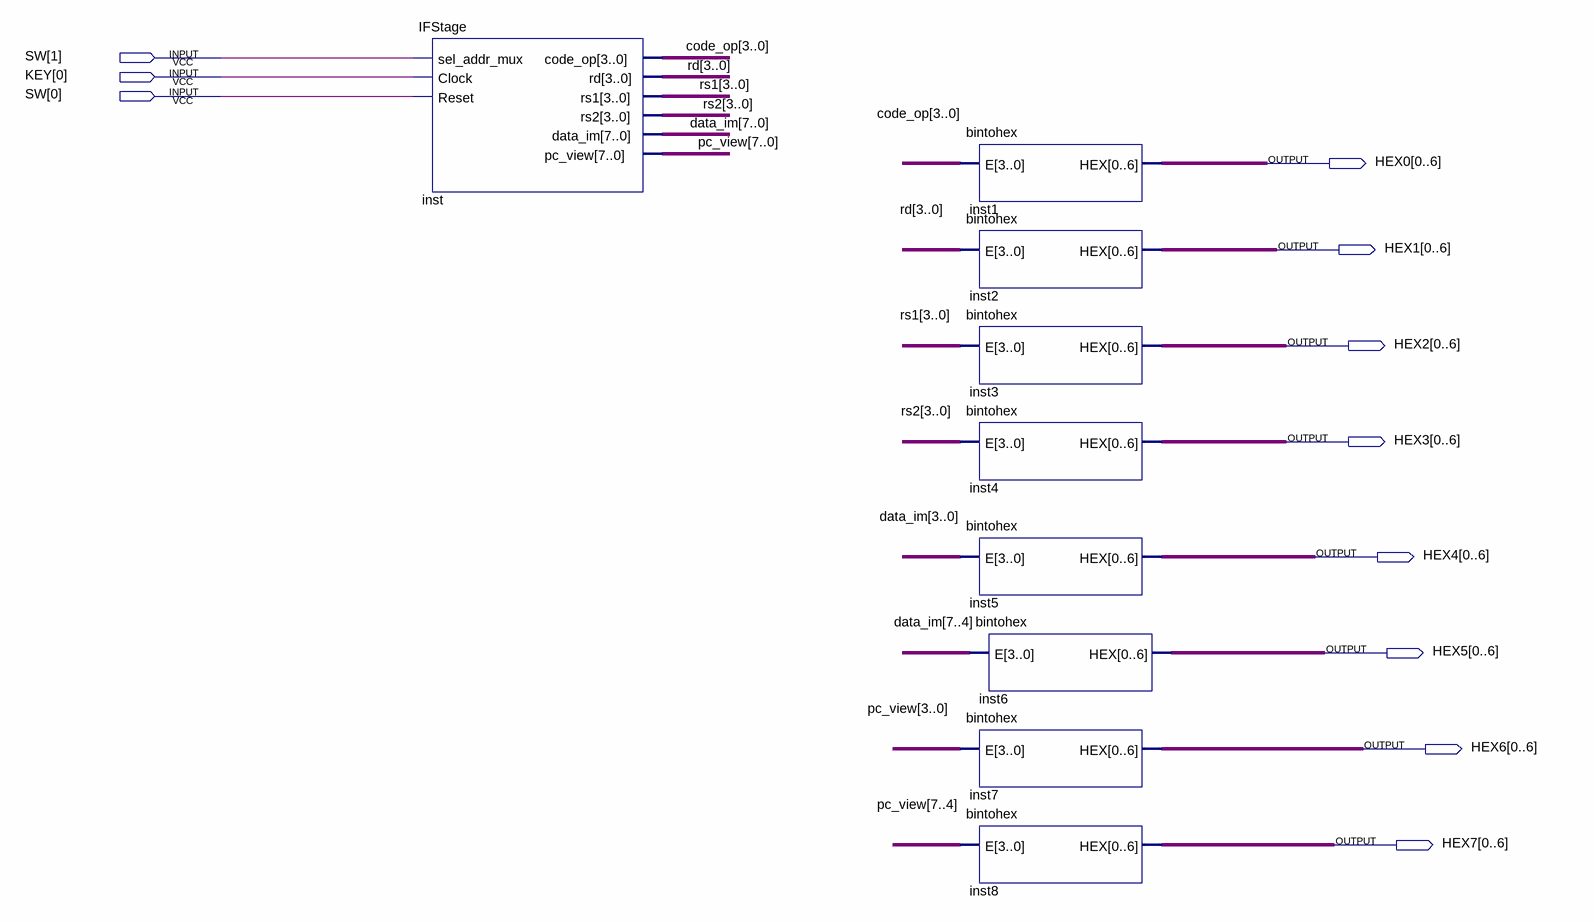
[diagram p0: schematic sheet]
// Quartus schematic testIFS.bdf as structural Verilog: 9 symbols, 11 pins
module testIFS (
  input  [1:0] SW,
  input  [0:0] KEY,
  output [0:6] HEX0,
  output [0:6] HEX1,
  output [0:6] HEX2,
  output [0:6] HEX3,
  output [0:6] HEX4,
  output [0:6] HEX5,
  output [0:6] HEX6,
  output [0:6] HEX7
);

  wire [3:0] code_op, rd, rs1, rs2;
  wire [7:0] data_im, pc_view;

  IFStage inst (
    .sel_addr_mux(SW[1]), .Clock(KEY[0]), .Reset(SW[0]), .code_op(code_op), .rd(rd), .rs1(rs1), .rs2(rs2),
    .data_im(data_im), .pc_view(pc_view));
  bintohex inst1 (.E(code_op), .HEX(HEX0));
  bintohex inst2 (.E(rd), .HEX(HEX1));
  bintohex inst3 (.E(rs1), .HEX(HEX2));
  bintohex inst4 (.E(rs2), .HEX(HEX3));
  bintohex inst5 (.E(data_im[3:0]), .HEX(HEX4));
  bintohex inst6 (.E(data_im[7:4]), .HEX(HEX5));
  bintohex inst7 (.E(pc_view[3:0]), .HEX(HEX6));
  bintohex inst8 (.E(pc_view[7:4]), .HEX(HEX7));
endmodule
